# Altium schematic sheet T4F81_FPGA.SchDoc
size 393 x 281 mm; SheetNumber: 3; SheetTotal: 3
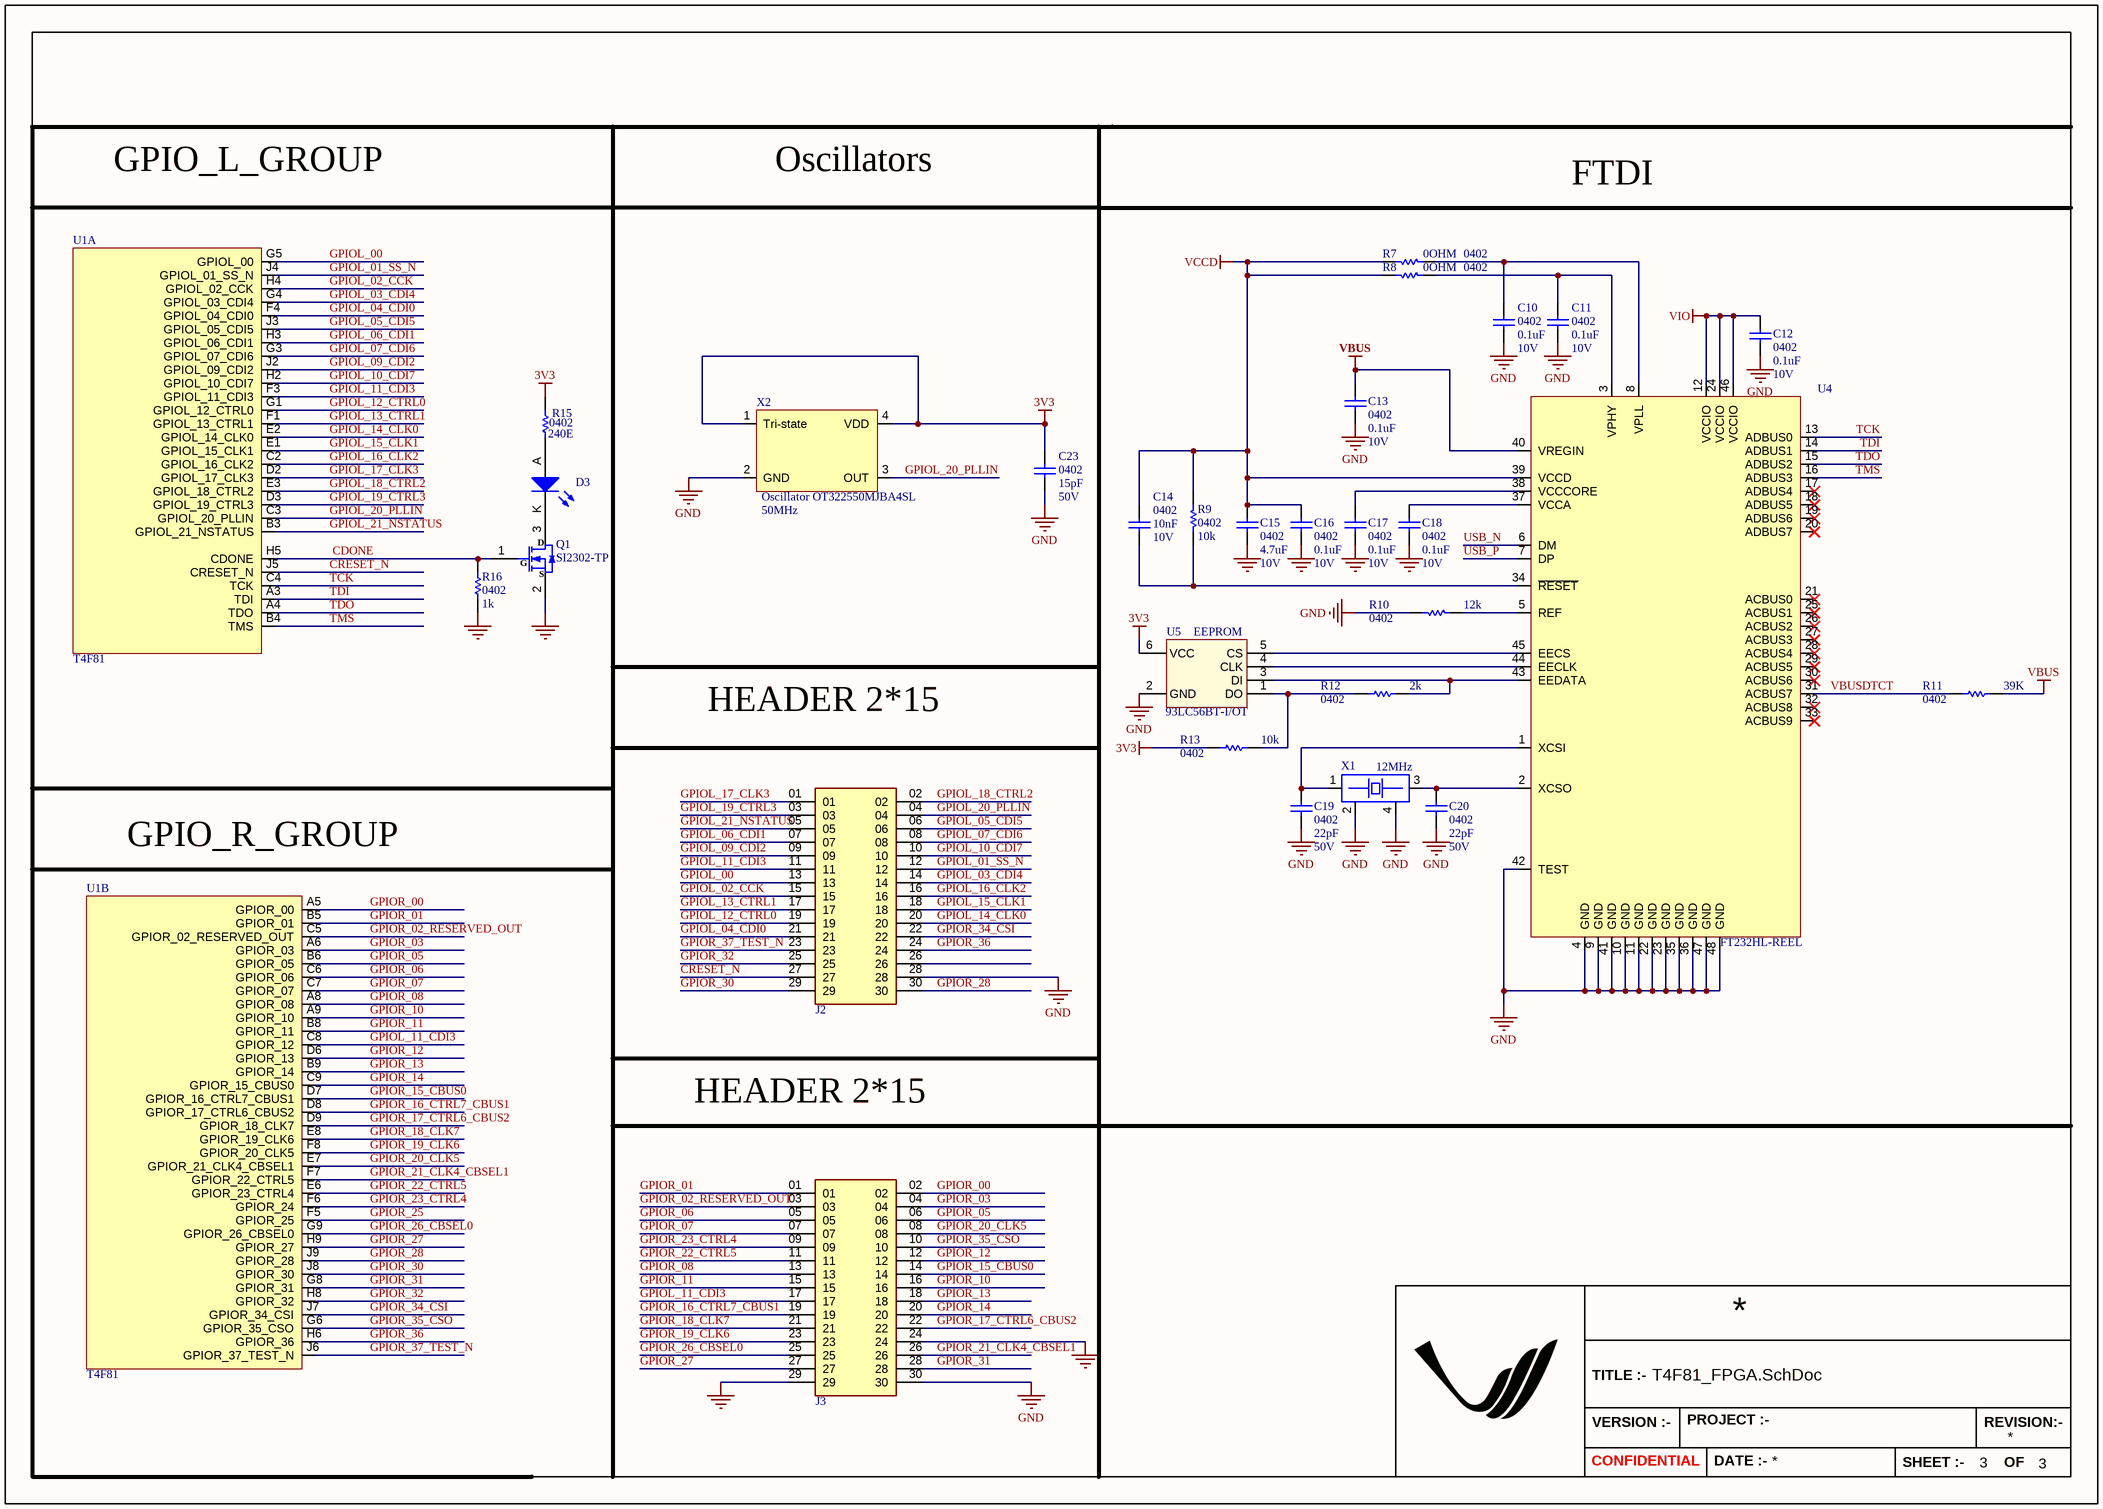
[diagram p0: T4F81_FPGA.SchDoc]

## Parts
C10  value 0.1uF  Case/Package: 0402  Voltage: 10V  [CAPC0402]
C11  value 0.1uF  Case/Package: 0402  Voltage: 10V  [CAPC0402]
C12  value 0.1uF  Case/Package: 0402  Voltage: 10V  [CAPC0402]
C13  value 0.1uF  Case/Package: 0402  Voltage: 10V  [CAPC0402]
C14  value 10nF  Case/Package: 0402  Voltage: 10V  [CAPC0402]
C15  value 4.7uF  Case/Package: 0402  Voltage: 10V  [CAPC0402]
C16  value 0.1uF  Case/Package: 0402  Voltage: 10V  [CAPC0402]
C17  value 0.1uF  Case/Package: 0402  Voltage: 10V  [CAPC0402]
C18  value 0.1uF  Case/Package: 0402  Voltage: 10V  [CAPC0402]
C19  value 22pF  Case/Package: 0402  Voltage: 50V  [CAPC0402]
C20  value 22pF  Case/Package: 0402  Voltage: 50V  [CAPC0402]
C23  value 15pF  Case/Package: 0402  Voltage: 50V  [CAPC0402]
D3  (no value)  [led_0603]
J2  Header 15X2 2.54mm  [Header_15X2_2.54]  (value not drawn)
J3  Header 15X2 2.54mm  [Header_15X2_2.54]  (value not drawn)
Q1  Manufacturer Part Number: SI2302-TP  [SOT23-3]
R7  value 0OHM  Case/Package: 0402  [resc0402]  (hidden comment: Res1)
R8  value 0OHM  Case/Package: 0402  [resc0402]  (hidden comment: Res1)
R9  value 10k  Case/Package: 0402  [RESC0402]  (hidden comment: Res1)
R10  value 12k  Case/Package: 0402  [resc0402]  (hidden comment: Res1)
R11  value 39K  Case/Package: 0402  [CAPC0402]  (hidden comment: Res1)
R12  value 2k  Case/Package: 0402  [resc0402]  (hidden comment: Res1)
R13  value 10k  Case/Package: 0402  [resc0402]  (hidden comment: Res1)
R15  value 240E  Case/Package: 0402  [RESC0402]
R16  value 1k  Case/Package: 0402  [RESC0402]
U1  T4F81  [T4F81 fpga]  (parts A,B of 3)
U4  Manufacturer Part Number: FT232HL-REEL  [LQFP-48]  (hidden comment: FTDI)
U5  Type: EEPROM  [SOT23-6]  (hidden comment: 93LC56BT-I/OT)
X1  Frequency: 12MHz  [Crystal_3225]  (hidden comment: XC2426TR-ND)
X2  Oscillator OT322550MJBA4SL  Frequency: 50MHz  [Crystal_3225]

## Nets
3V3: C23.2 R13.1 R15.2 U5.6(VCC) X2.1(Tri-state) X2.4(VDD)
GND: C10.1 C11.1 C12.1 C13.1 C15.1 C16.1 C17.1 C18.1 C19.1 C20.1 C23.1 J2.28 J3.24 J3.29 J3.30 Q1.2(S) R10.1 R16.2 U4.4(GND) U4.9(GND) U4.10(GND) U4.11(GND) U4.22(GND) U4.23(GND) U4.35(GND) U4.36(GND) U4.41(GND) U4.42(TEST) U4.47(GND) U4.48(GND) U5.2(GND) X1.2 X1.4 X2.2(GND)
VBUS: C13.2 R11.1 U4.40(VREGIN)
VCCD: C14.2 C15.2 C16.2 R7.2 R8.2 R9.2 U4.39(VCCD)
VIO: C12.2 U4.12(VCCIO) U4.24(VCCIO) U4.46(VCCIO)
CDONE: Q1.1(G) R16.1 U1.H5(CDONE)
CRESET_N: J2.27 U1.J5(CRESET_N)
GPIOL_00: J2.13 U1.G5(GPIOL_00)
GPIOL_01_SS_N: J2.12 U1.J4(GPIOL_01_SS_N)
GPIOL_02_CCK: J2.15 U1.H4(GPIOL_02_CCK)
GPIOL_03_CDI4: J2.14 U1.G4(GPIOL_03_CDI4)
GPIOL_04_CDI0: J2.21 U1.F4(GPIOL_04_CDI0)
GPIOL_05_CDI5: J2.06 U1.J3(GPIOL_05_CDI5)
GPIOL_06_CDI1: J2.07 U1.H3(GPIOL_06_CDI1)
GPIOL_07_CDI6: J2.08 U1.G3(GPIOL_07_CDI6)
GPIOL_09_CDI2: J2.09 U1.J2(GPIOL_09_CDI2)
GPIOL_10_CDI7: J2.10 U1.H2(GPIOL_10_CDI7)
GPIOL_11_CDI3: J2.11 J3.17 U1.C8(GPIOR_12) U1.F3(GPIOL_11_CDI3)
GPIOL_12_CTRL0: J2.19 U1.G1(GPIOL_12_CTRL0)
GPIOL_13_CTRL1: J2.17 U1.F1(GPIOL_13_CTRL1)
GPIOL_14_CLK0: J2.20 U1.E2(GPIOL_14_CLK0)
GPIOL_15_CLK1: J2.18 U1.E1(GPIOL_15_CLK1)
GPIOL_16_CLK2: J2.16 U1.C2(GPIOL_16_CLK2)
GPIOL_17_CLK3: J2.01 U1.D2(GPIOL_17_CLK3)
GPIOL_18_CTRL2: J2.02 U1.E3(GPIOL_18_CTRL2)
GPIOL_19_CTRL3: J2.03 U1.D3(GPIOL_19_CTRL3)
GPIOL_20_PLLIN: J2.04 U1.C3(GPIOL_20_PLLIN) X2.3(OUT)
GPIOL_21_NSTATUS: J2.05 U1.B3(GPIOL_21_NSTATUS)
GPIOR_00: J3.02 U1.A5(GPIOR_00)
GPIOR_01: J3.01 U1.B5(GPIOR_01)
GPIOR_02_RESERVED_OUT: J3.03 U1.C5(GPIOR_02_RESERVED_OUT)
GPIOR_03: J3.04 U1.A6(GPIOR_03)
GPIOR_05: J3.06 U1.B6(GPIOR_05)
GPIOR_06: J3.05 U1.C6(GPIOR_06)
GPIOR_07: J3.07 U1.C7(GPIOR_07)
GPIOR_08: J3.13 U1.A8(GPIOR_08)
GPIOR_10: J3.16 U1.A9(GPIOR_10)
GPIOR_11: J3.15 U1.B8(GPIOR_11)
GPIOR_12: J3.12 U1.D6(GPIOR_13)
GPIOR_13: J3.18 U1.B9(GPIOR_14)
GPIOR_14: J3.20 U1.C9(GPIOR_15_CBUS0)
GPIOR_15_CBUS0: J3.14 U1.D7(GPIOR_16_CTRL7_CBUS1)
GPIOR_16_CTRL7_CBUS1: J3.19 U1.D8(GPIOR_17_CTRL6_CBUS2)
GPIOR_17_CTRL6_CBUS2: J3.22 U1.D9(GPIOR_18_CLK7)
GPIOR_18_CLK7: J3.21 U1.E8(GPIOR_19_CLK6)
GPIOR_19_CLK6: J3.23 U1.F8(GPIOR_20_CLK5)
GPIOR_20_CLK5: J3.08 U1.E7(GPIOR_21_CLK4_CBSEL1)
GPIOR_21_CLK4_CBSEL1: J3.26 U1.F7(GPIOR_22_CTRL5)
GPIOR_22_CTRL5: J3.11 U1.E6(GPIOR_23_CTRL4)
GPIOR_23_CTRL4: J3.09 U1.F6(GPIOR_24)
GPIOR_25: U1.F5(GPIOR_25)
GPIOR_26_CBSEL0: J3.25 U1.G9(GPIOR_26_CBSEL0)
GPIOR_27: J3.27 U1.H9(GPIOR_27)
GPIOR_28: J2.30 U1.J9(GPIOR_28)
GPIOR_30: J2.29 U1.J8(GPIOR_30)
GPIOR_31: J3.28 U1.G8(GPIOR_31)
GPIOR_32: J2.25 U1.H8(GPIOR_32)
GPIOR_34_CSI: J2.22 U1.J7(GPIOR_34_CSI)
GPIOR_35_CSO: J3.10 U1.G6(GPIOR_35_CSO)
GPIOR_36: J2.24 U1.H6(GPIOR_36)
GPIOR_37_TEST_N: J2.23 U1.J6(GPIOR_37_TEST_N)
TCK: U1.C4(TCK) U4.13(ADBUS0)
TDI: U1.A3(TDI) U4.14(ADBUS1)
TDO: U1.A4(TDO) U4.15(ADBUS2)
TMS: U1.B4(TMS) U4.16(ADBUS3)
USB_N: U4.6(DM)
USB_P: U4.7(DP)
VBUSDTCT: R11.2 U4.31(ACBUS7)
NetC10_2: C10.2 R7.1 U4.8(VPLL)
NetC11_2: C11.2 R8.1 U4.3(VPHY)
NetC14_1: C14.1 R9.1 U4.34(~{RESET})
NetC17_2: C17.2 U4.38(VCCCORE)
NetC18_2: C18.2 U4.37(VCCA)
NetC19_2: C19.2 U4.1(XCSI) X1.1
NetC20_2: C20.2 U4.2(XCSO) X1.3
NetD3_A: D3.A R15.1
NetD3_K: D3.K Q1.3(D)
NetR10_2: R10.2 U4.5(REF)
NetR12_1: R12.1 R13.2 U5.1(DO)
NetR12_2: R12.2 U4.43(EEDATA) U5.3(DI)
NetU4_44: U4.44(EECLK) U5.4(CLK)
NetU4_45: U4.45(EECS) U5.5(CS)

Not connected (* = marked no-connect by the designer): J2 26; U4 17(ADBUS4)* 18(ADBUS5)* 19(ADBUS6)* 20(ADBUS7)* 21(ACBUS0)* 25(ACBUS1)* 26(ACBUS2)* 27(ACBUS3)* 28(ACBUS4)* 29(ACBUS5)* 30(ACBUS6)* 32(ACBUS8)* 33(ACBUS9)*

## Notes on the sheet
- GPIO_L_GROUP
- Oscillators
- FTDI
- HEADER 2*15
- GPIO_R_GROUP
- TITLE :-
- VERSION :-
- PROJECT :-
- SHEET :-
- REVISION:-
- OF
- CONFIDENTIAL
- DATE :-

## Library data of the parts
C10-C13 = Capacitor: Ceramic Capacitor, 0.1uF, 0402,10V; Manufacturer Part Number: *
C14 = Capacitor: Ceramic Capacitor, 10nF, 0402,10V; Manufacturer Part Number: *
C15 = Capacitor: Ceramic Capacitor, 4.7uF, 0402,10V; Manufacturer Part Number: *
C16-C18 = Capacitor: Ceramic Capacitor, 0.1UF, 0402,10V; Manufacturer Part Number: *
C19 C20 = Capacitor: Ceramic Capacitor, 22pF, 0402,50V; Manufacturer Part Number: *; Vicharak-PN: *
C23 = Capacitor: Ceramic Capacitor, 15pF, 0402,50V; Manufacturer Part Number: *; Vicharak-PN: *
D3 = LED1: GREEN LED, 0603; Manufacturer Part Number: GREEN; Case/Package: 0603
J2 J3 = Header 15X2 2.54mm: Connector Header position; Manufacturer Part Number: Th P2.54MM; Case/Package: TH; Parameter 1: *
Q1 = MOSFET Si2302CDS: N-Channel 20V 3A 1.25W (Ta) Surface Mount SOT-23; Case/Package: SOT-23
R7 = Res1: Thick Film Resistor -  0ohm, 1%, 0402; Manufacturer Part Number: RC0402FR-070RL; ComponentLink1URL: http://uk.rs-online.com/webdocs/0d98/0900766b80d98824.pdf?src-supplier=RSComponents; ComponentLink1Description: http://uk.rs-online.com/webdocs/0d98/0900766b80d98824.pdf?src-supplier=RSComponents; ComponentLink2URL: http://www.vishay.com/docs/20035/dcrcwe3.pdf?src-supplier=Digi-Key; ComponentLink2Description: http://www.vishay.com/docs/20035/dcrcwe3.pdf?src-supplier=Digi-Key; ComponentLink3URL: http://www.farnell.com/datasheets/2045673.pdf?src-supplier=Element14; ComponentLink3Description: http://www.farnell.com/datasheets/2045673.pdf?src-supplier=Element14; ComponentLink4URL: http://www.vishay.com/docs/20035/dcrcwe3.pdf?src-supplier=Avnet; ComponentLink4Description: http://www.vishay.com/docs/20035/dcrcwe3.pdf?src-supplier=Avnet; ComponentLink5URL: https://www.distrelec.biz/Web/Downloads/a_/en/flD-CRCW-e3_data_en.pdf?mime=application%2Fpdf&src-supplier=Distrelec; ComponentLink5Description: https://www.distrelec.biz/Web/Downloads/a_/en/flD-CRCW-e3_data_en.pdf?mime=application%2Fpdf&src-supplier=Distrelec; ComponentLink6URL: http://www.vishay.com/docs/20035/dcrcwe3.pdf?src-supplier=Mouser; ComponentLink6Description: http://www.vishay.com/docs/20035/dcrcwe3.pdf?src-supplier=Mouser; ComponentLink7URL: http://www.farnell.com/datasheets/2111203.pdf?src-supplier=Element14; ComponentLink7Description: http://www.farnell.com/datasheets/2111203.pdf?src-supplier=Element14; ComponentLink8URL: http://www.vishay.com/docs/20035/dcrcwe3.pdf?src-supplier=Future+Electronics; ComponentLink8Description: http://www.vishay.com/docs/20035/dcrcwe3.pdf?src-supplier=Future+Electronics; ComponentLink9URL: https://www.te.com/commerce/DocumentDelivery/DDEController?Action=srchrtrv&amp;DocNm=1773204-3&amp;DocType=DS&amp;DocLang=English&src-supplier=Digi-Key; ComponentLink9Description: https://www.te.com/commerce/DocumentDelivery/DDEController?Action=srchrtrv&amp;DocNm=1773204-3&amp;DocType=DS&amp;DocLang=English&src-supplier=Digi-Key; ComponentLink10URL: https://4donline.ihs.com/images/VipMasterIC/IC/TYEL/TYEL-S-A0004929575/TYEL-S-A0004929575-1.pdf?hkey=52A5661711E402568146F3353EA87419&src-supplier=Farnell; ComponentLink10Description: https://4donline.ihs.com/images/VipMasterIC/IC/TYEL/TYEL-S-A0004929575/TYEL-S-A0004929575-1.pdf?hkey=52A5661711E402568146F3353EA87419&src-supplier=Farnell; ComponentLink11URL: https://4donline.ihs.com/images/VipMasterIC/IC/TYEL/TYEL-S-A0004929575/TYEL-S-A0004929575-1.pdf?hkey=52A5661711E402568146F3353EA87419&src-supplier=Newark; ComponentLink11Description: https://4donline.ihs.com/images/VipMasterIC/IC/TYEL/TYEL-S-A0004929575/TYEL-S-A0004929575-1.pdf?hkey=52A5661711E402568146F3353EA87419&src-supplier=Newark; Parameter 1: *
R8 = Res1: Thick Film Resistor -  0ohm, 1%, 0402; ComponentLink1URL: http://uk.rs-online.com/webdocs/0d98/0900766b80d98824.pdf?src-supplier=RSComponents; ComponentLink1Description: http://uk.rs-online.com/webdocs/0d98/0900766b80d98824.pdf?src-supplier=RSComponents; ComponentLink2URL: http://www.vishay.com/docs/20035/dcrcwe3.pdf?src-supplier=Digi-Key; ComponentLink2Description: http://www.vishay.com/docs/20035/dcrcwe3.pdf?src-supplier=Digi-Key; ComponentLink3URL: http://www.farnell.com/datasheets/2045673.pdf?src-supplier=Element14; ComponentLink3Description: http://www.farnell.com/datasheets/2045673.pdf?src-supplier=Element14; ComponentLink4URL: http://www.vishay.com/docs/20035/dcrcwe3.pdf?src-supplier=Avnet; ComponentLink4Description: http://www.vishay.com/docs/20035/dcrcwe3.pdf?src-supplier=Avnet; ComponentLink5URL: https://www.distrelec.biz/Web/Downloads/a_/en/flD-CRCW-e3_data_en.pdf?mime=application%2Fpdf&src-supplier=Distrelec; ComponentLink5Description: https://www.distrelec.biz/Web/Downloads/a_/en/flD-CRCW-e3_data_en.pdf?mime=application%2Fpdf&src-supplier=Distrelec; ComponentLink6URL: http://www.vishay.com/docs/20035/dcrcwe3.pdf?src-supplier=Mouser; ComponentLink6Description: http://www.vishay.com/docs/20035/dcrcwe3.pdf?src-supplier=Mouser; ComponentLink7URL: http://www.farnell.com/datasheets/2111203.pdf?src-supplier=Element14; ComponentLink7Description: http://www.farnell.com/datasheets/2111203.pdf?src-supplier=Element14; ComponentLink8URL: http://www.vishay.com/docs/20035/dcrcwe3.pdf?src-supplier=Future+Electronics; ComponentLink8Description: http://www.vishay.com/docs/20035/dcrcwe3.pdf?src-supplier=Future+Electronics; ComponentLink9URL: https://www.te.com/commerce/DocumentDelivery/DDEController?Action=srchrtrv&amp;DocNm=1773204-3&amp;DocType=DS&amp;DocLang=English&src-supplier=Digi-Key; ComponentLink9Description: https://www.te.com/commerce/DocumentDelivery/DDEController?Action=srchrtrv&amp;DocNm=1773204-3&amp;DocType=DS&amp;DocLang=English&src-supplier=Digi-Key; ComponentLink10URL: https://4donline.ihs.com/images/VipMasterIC/IC/TYEL/TYEL-S-A0004929575/TYEL-S-A0004929575-1.pdf?hkey=52A5661711E402568146F3353EA87419&src-supplier=Farnell; ComponentLink10Description: https://4donline.ihs.com/images/VipMasterIC/IC/TYEL/TYEL-S-A0004929575/TYEL-S-A0004929575-1.pdf?hkey=52A5661711E402568146F3353EA87419&src-supplier=Farnell; ComponentLink11URL: https://4donline.ihs.com/images/VipMasterIC/IC/TYEL/TYEL-S-A0004929575/TYEL-S-A0004929575-1.pdf?hkey=52A5661711E402568146F3353EA87419&src-supplier=Newark; ComponentLink11Description: https://4donline.ihs.com/images/VipMasterIC/IC/TYEL/TYEL-S-A0004929575/TYEL-S-A0004929575-1.pdf?hkey=52A5661711E402568146F3353EA87419&src-supplier=Newark
R9 R13 = Res1: Thick Film Resistor -  10Kohm, 1%, 0402
  R9: ComponentLink1URL: http://uk.rs-online.com/webdocs/0d98/0900766b80d98824.pdf?src-supplier=RSComponents; ComponentLink1Description: http://uk.rs-online.com/webdocs/0d98/0900766b80d98824.pdf?src-supplier=RSComponents; ComponentLink2URL: http://www.vishay.com/docs/20035/dcrcwe3.pdf?src-supplier=Digi-Key; ComponentLink2Description: http://www.vishay.com/docs/20035/dcrcwe3.pdf?src-supplier=Digi-Key; ComponentLink3URL: http://www.farnell.com/datasheets/2045673.pdf?src-supplier=Element14; ComponentLink3Description: http://www.farnell.com/datasheets/2045673.pdf?src-supplier=Element14; ComponentLink4URL: http://www.vishay.com/docs/20035/dcrcwe3.pdf?src-supplier=Avnet; ComponentLink4Description: http://www.vishay.com/docs/20035/dcrcwe3.pdf?src-supplier=Avnet; ComponentLink5URL: https://www.distrelec.biz/Web/Downloads/a_/en/flD-CRCW-e3_data_en.pdf?mime=application%2Fpdf&src-supplier=Distrelec; ComponentLink5Description: https://www.distrelec.biz/Web/Downloads/a_/en/flD-CRCW-e3_data_en.pdf?mime=application%2Fpdf&src-supplier=Distrelec; ComponentLink6URL: http://www.vishay.com/docs/20035/dcrcwe3.pdf?src-supplier=Mouser; ComponentLink6Description: http://www.vishay.com/docs/20035/dcrcwe3.pdf?src-supplier=Mouser; ComponentLink7URL: http://www.farnell.com/datasheets/2111203.pdf?src-supplier=Element14; ComponentLink7Description: http://www.farnell.com/datasheets/2111203.pdf?src-supplier=Element14; ComponentLink8URL: http://www.vishay.com/docs/20035/dcrcwe3.pdf?src-supplier=Future+Electronics; ComponentLink8Description: http://www.vishay.com/docs/20035/dcrcwe3.pdf?src-supplier=Future+Electronics; ComponentLink9URL: https://www.te.com/commerce/DocumentDelivery/DDEController?Action=srchrtrv&amp;DocNm=1773204-3&amp;DocType=DS&amp;DocLang=English&src-supplier=Digi-Key; ComponentLink9Description: https://www.te.com/commerce/DocumentDelivery/DDEController?Action=srchrtrv&amp;DocNm=1773204-3&amp;DocType=DS&amp;DocLang=English&src-supplier=Digi-Key; ComponentLink10URL: https://4donline.ihs.com/images/VipMasterIC/IC/TYEL/TYEL-S-A0004929575/TYEL-S-A0004929575-1.pdf?hkey=52A5661711E402568146F3353EA87419&src-supplier=Farnell; ComponentLink10Description: https://4donline.ihs.com/images/VipMasterIC/IC/TYEL/TYEL-S-A0004929575/TYEL-S-A0004929575-1.pdf?hkey=52A5661711E402568146F3353EA87419&src-supplier=Farnell; ComponentLink11URL: https://4donline.ihs.com/images/VipMasterIC/IC/TYEL/TYEL-S-A0004929575/TYEL-S-A0004929575-1.pdf?hkey=52A5661711E402568146F3353EA87419&src-supplier=Newark; ComponentLink11Description: https://4donline.ihs.com/images/VipMasterIC/IC/TYEL/TYEL-S-A0004929575/TYEL-S-A0004929575-1.pdf?hkey=52A5661711E402568146F3353EA87419&src-supplier=Newark
  R13: Vicharak-PN: *
R10 = Res1: Thick Film Resistor -  12Kohm, 1%, 0402; ComponentLink1URL: http://uk.rs-online.com/webdocs/0d98/0900766b80d98824.pdf?src-supplier=RSComponents; ComponentLink1Description: http://uk.rs-online.com/webdocs/0d98/0900766b80d98824.pdf?src-supplier=RSComponents; ComponentLink2URL: http://www.vishay.com/docs/20035/dcrcwe3.pdf?src-supplier=Digi-Key; ComponentLink2Description: http://www.vishay.com/docs/20035/dcrcwe3.pdf?src-supplier=Digi-Key; ComponentLink3URL: http://www.farnell.com/datasheets/2045673.pdf?src-supplier=Element14; ComponentLink3Description: http://www.farnell.com/datasheets/2045673.pdf?src-supplier=Element14; ComponentLink4URL: http://www.vishay.com/docs/20035/dcrcwe3.pdf?src-supplier=Avnet; ComponentLink4Description: http://www.vishay.com/docs/20035/dcrcwe3.pdf?src-supplier=Avnet; ComponentLink5URL: https://www.distrelec.biz/Web/Downloads/a_/en/flD-CRCW-e3_data_en.pdf?mime=application%2Fpdf&src-supplier=Distrelec; ComponentLink5Description: https://www.distrelec.biz/Web/Downloads/a_/en/flD-CRCW-e3_data_en.pdf?mime=application%2Fpdf&src-supplier=Distrelec; ComponentLink6URL: http://www.vishay.com/docs/20035/dcrcwe3.pdf?src-supplier=Mouser; ComponentLink6Description: http://www.vishay.com/docs/20035/dcrcwe3.pdf?src-supplier=Mouser; ComponentLink7URL: http://www.farnell.com/datasheets/2111203.pdf?src-supplier=Element14; ComponentLink7Description: http://www.farnell.com/datasheets/2111203.pdf?src-supplier=Element14; ComponentLink8URL: http://www.vishay.com/docs/20035/dcrcwe3.pdf?src-supplier=Future+Electronics; ComponentLink8Description: http://www.vishay.com/docs/20035/dcrcwe3.pdf?src-supplier=Future+Electronics; ComponentLink9URL: https://www.te.com/commerce/DocumentDelivery/DDEController?Action=srchrtrv&amp;DocNm=1773204-3&amp;DocType=DS&amp;DocLang=English&src-supplier=Digi-Key; ComponentLink9Description: https://www.te.com/commerce/DocumentDelivery/DDEController?Action=srchrtrv&amp;DocNm=1773204-3&amp;DocType=DS&amp;DocLang=English&src-supplier=Digi-Key; ComponentLink10URL: https://4donline.ihs.com/images/VipMasterIC/IC/TYEL/TYEL-S-A0004929575/TYEL-S-A0004929575-1.pdf?hkey=52A5661711E402568146F3353EA87419&src-supplier=Farnell; ComponentLink10Description: https://4donline.ihs.com/images/VipMasterIC/IC/TYEL/TYEL-S-A0004929575/TYEL-S-A0004929575-1.pdf?hkey=52A5661711E402568146F3353EA87419&src-supplier=Farnell; ComponentLink11URL: https://4donline.ihs.com/images/VipMasterIC/IC/TYEL/TYEL-S-A0004929575/TYEL-S-A0004929575-1.pdf?hkey=52A5661711E402568146F3353EA87419&src-supplier=Newark; ComponentLink11Description: https://4donline.ihs.com/images/VipMasterIC/IC/TYEL/TYEL-S-A0004929575/TYEL-S-A0004929575-1.pdf?hkey=52A5661711E402568146F3353EA87419&src-supplier=Newark
R11 = Res1: Thick Film Resistor -  39Kohm, 1%, 0402; Manufacturer Part Number: *
R12 = Res1: Thick Film Resistor -  2Kohm, 1%, 0402
R15 = Res: Thick Film Resistor -  240ohm, 1%, 0402
R16 = Res: Thick Film Resistor -  1Kohm, 1%, 0402
U4 = FT232HL: FT232HL, 1.62V~1.98V,  2.97V~3.63V, 24mA, 48Pin, 48-LQFP, USB Bridge, USB to UART, FIFO, Controller; Vicharak-PN: V001843; Case/Package: LQFP-48_7x7x05P; Type: IC
U5 = 93LC56BT-I/OT: MICROCHIP - 93LC56BT-I/OT. - 2K, 128 X 16, SERIAL EE, IND ROHS COMPLIANT: YES; Vicharak-PN: V001522; Case/Package: SOT-23-6; ComponentLink1URL: https://datasheet.ciiva.com/48496/jp013939-48496476.pdf?src-supplier=Avnet; ComponentLink1Description: https://datasheet.ciiva.com/48496/jp013939-48496476.pdf?src-supplier=Avnet; ComponentLink2URL: https://datasheet.ciiva.com/16216/filehandler-aspxddocname-en013939-16216574.pdf?src-supplier=Future+Electronics; ComponentLink2Description: https://datasheet.ciiva.com/16216/filehandler-aspxddocname-en013939-16216574.pdf?src-supplier=Future+Electronics; ComponentLink3URL: https://datasheet.ciiva.com/3185/jp013939-3185519.pdf?src-supplier=Avnet; ComponentLink3Description: https://datasheet.ciiva.com/3185/jp013939-3185519.pdf?src-supplier=Avnet; ComponentLink4URL: https://datasheet.ciiva.com/16622/jp013939-16622127.pdf?src-supplier=Avnet+Europe; ComponentLink4Description: https://datasheet.ciiva.com/16622/jp013939-16622127.pdf?src-supplier=Avnet+Europe; Manufacturer Part Number: 93LC56BT-I/OT
X1 = CRYSTAL_1_1: CRYSTAL 12.0000MHZ 10PF SMD; Manufacturer Part Number: ECS-120-10-33B-CKM-TR; Case/Package: SMD-3225; Vicharak-PN: *
X2 = Oscillator OT322550MJBA4SL: 1.8V~3.3V -40℃~+85℃ ±10ppm 50MHz SMD3225-4P Oscillators ROHS (OT322550MJBA4SL) (C717684); Vicharak-PN: V000176; Manufacturer Part Number: OT322550MJBA4SL; Case/Package: SMD3225
U1 = T4F81: Manufacturer_Part_Number: T4F81; Case/Package: *; Vicharak-PN: *; Type: *